# Altium schematic sheet BeeWatch_Rev3.SchDoc: BeeWatchRev3
size A; Revision: 1.0; SheetNumber: 6; SheetTotal: 6
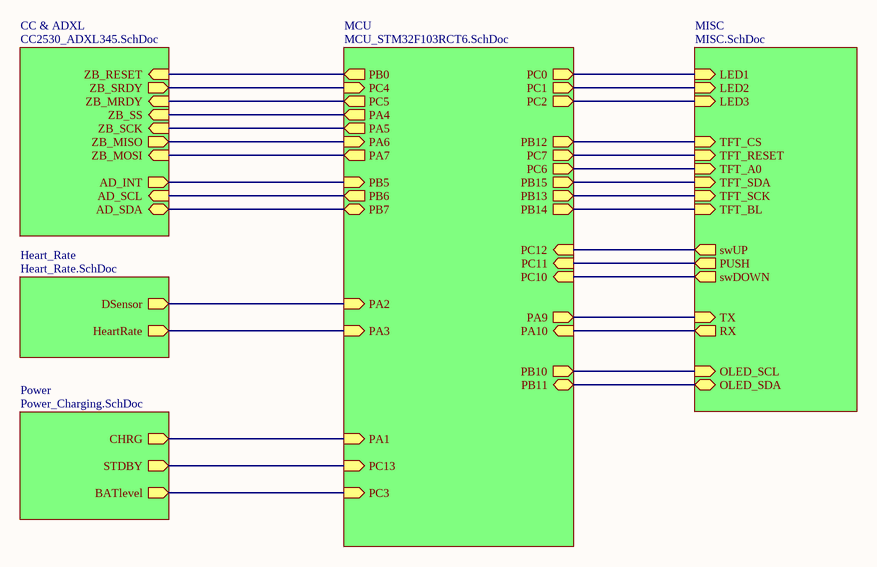
[diagram p0: BeeWatch_Rev3.SchDoc]

## Sub-sheets
CC & ADXL = CC2530_ADXL345.SchDoc: ZB_RESET (in), ZB_MRDY (in), ZB_SRDY (out), ZB_SS (in), ZB_SCK (in), ZB_MISO (out), ZB_MOSI (in), AD_INT (out), AD_SCL (in), AD_SDA (bidir)
Heart_Rate = Heart_Rate.SchDoc: DSensor (out), HeartRate (out)
MCU = MCU_STM32F103RCT6.SchDoc: PB0 (out), PC4 (in), PC5 (out), PA4 (out), PA5 (out), PA6 (in), PA7 (out), PB5 (in), PB6 (out), PB7 (bidir), PA2 (in), PA3 (in), PC3 (in), PC13 (in), PA1 (in), PC0 (out), PC1 (out), PC2 (out), PB12 (out), PC6 (out), PC7 (out), PB15 (out), PB13 (out), PB14 (out), PC12 (in), PC11 (in), PC10 (in), PA9 (out), PA10 (in), PB10 (out), PB11 (bidir)
MISC = MISC.SchDoc: LED1 (in), LED2 (in), LED3 (in), TFT_CS (in), TFT_RESET (in), TFT_A0 (in), TFT_SDA (in), TFT_SCK (in), TFT_BL (in), swUP (out), PUSH (out), swDOWN (out), TX (in), RX (out), OLED_SCL (in), OLED_SDA (bidir)
Power = Power_Charging.SchDoc: CHRG (out), STDBY (out), BATlevel (out)

## Nets
(unnamed): sheet MCU/PB0, sheet CC & ADXL/ZB_RESET
(unnamed): sheet MCU/PC4, sheet CC & ADXL/ZB_SRDY
(unnamed): sheet MCU/PC5, sheet CC & ADXL/ZB_MRDY
(unnamed): sheet MCU/PA4, sheet CC & ADXL/ZB_SS
(unnamed): sheet MCU/PA5, sheet CC & ADXL/ZB_SCK
(unnamed): sheet MCU/PA6, sheet CC & ADXL/ZB_MISO
(unnamed): sheet MCU/PA7, sheet CC & ADXL/ZB_MOSI
(unnamed): sheet MCU/PB5, sheet CC & ADXL/AD_INT
(unnamed): sheet MCU/PB6, sheet CC & ADXL/AD_SCL
(unnamed): sheet MCU/PB7, sheet CC & ADXL/AD_SDA
(unnamed): sheet MCU/PA2, sheet Heart_Rate/DSensor
(unnamed): sheet MCU/PA3, sheet Heart_Rate/HeartRate
(unnamed): sheet MCU/PC3, sheet Power/BATlevel
(unnamed): sheet MCU/PC13, sheet Power/STDBY
(unnamed): sheet MCU/PA1, sheet Power/CHRG
(unnamed): sheet MCU/PC0, sheet MISC/LED1
(unnamed): sheet MCU/PC1, sheet MISC/LED2
(unnamed): sheet MCU/PC2, sheet MISC/LED3
(unnamed): sheet MCU/PB12, sheet MISC/TFT_CS
(unnamed): sheet MCU/PC6, sheet MISC/TFT_A0
(unnamed): sheet MCU/PC7, sheet MISC/TFT_RESET
(unnamed): sheet MCU/PB15, sheet MISC/TFT_SDA
(unnamed): sheet MCU/PB13, sheet MISC/TFT_SCK
(unnamed): sheet MCU/PB14, sheet MISC/TFT_BL
(unnamed): sheet MCU/PC12, sheet MISC/swUP
(unnamed): sheet MCU/PC11, sheet MISC/PUSH
(unnamed): sheet MCU/PC10, sheet MISC/swDOWN
(unnamed): sheet MCU/PA9, sheet MISC/TX
(unnamed): sheet MCU/PA10, sheet MISC/RX
(unnamed): sheet MCU/PB10, sheet MISC/OLED_SCL
(unnamed): sheet MCU/PB11, sheet MISC/OLED_SDA

## Notes on the sheet
- Title
- Size:
- Date:
- A
- Number:
- Time:
- Revision:
- Sheet
- of
- File: